# EAGLE schematic LPmini-Prototype_1.1 (EAGLE 6.4)
COMPANY: ADAFRUIT INDUSTRIES; DRAWN: KTOWN; REV: B
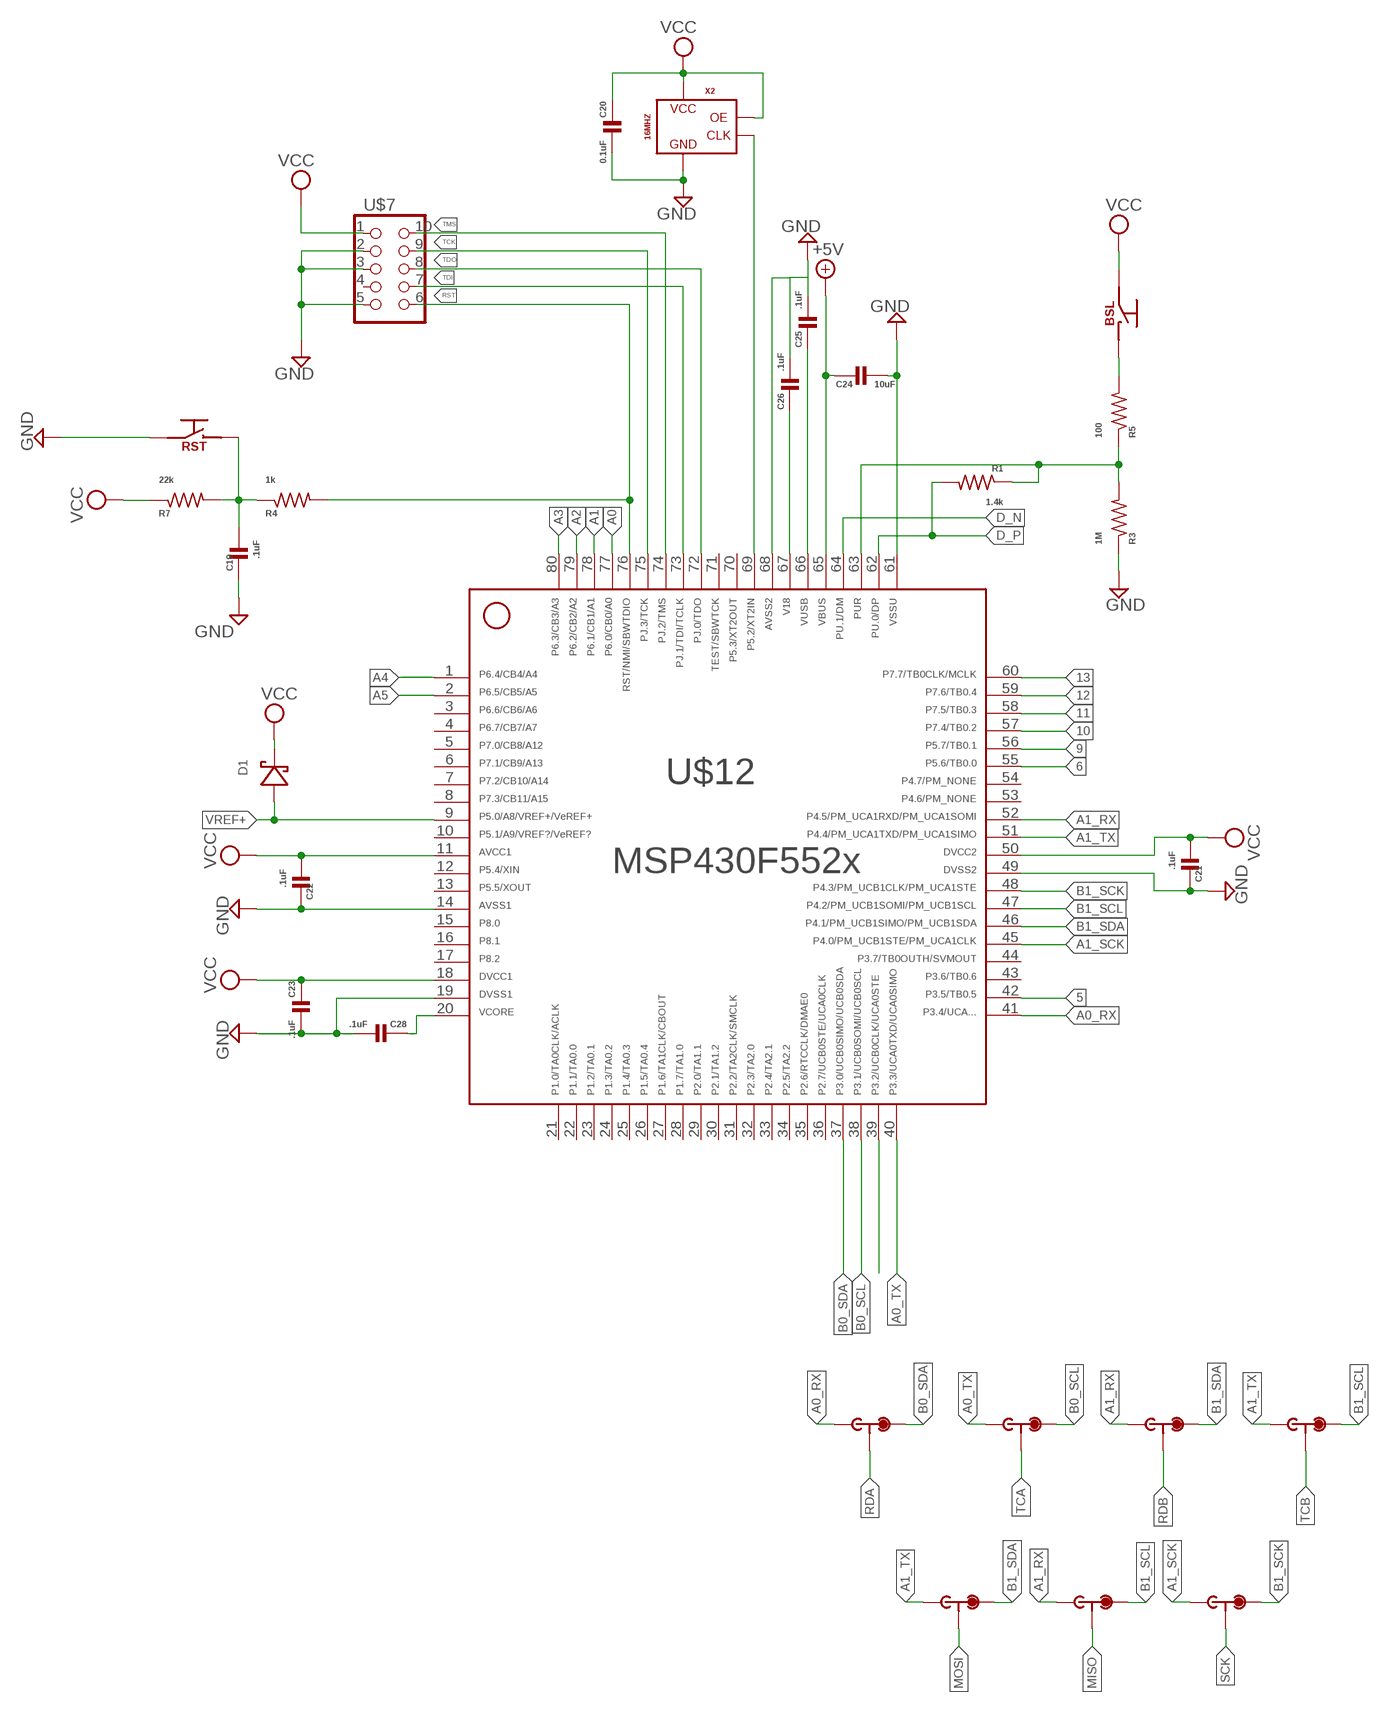
[diagram p0: schematic, sheet 1, part 1 of 2]
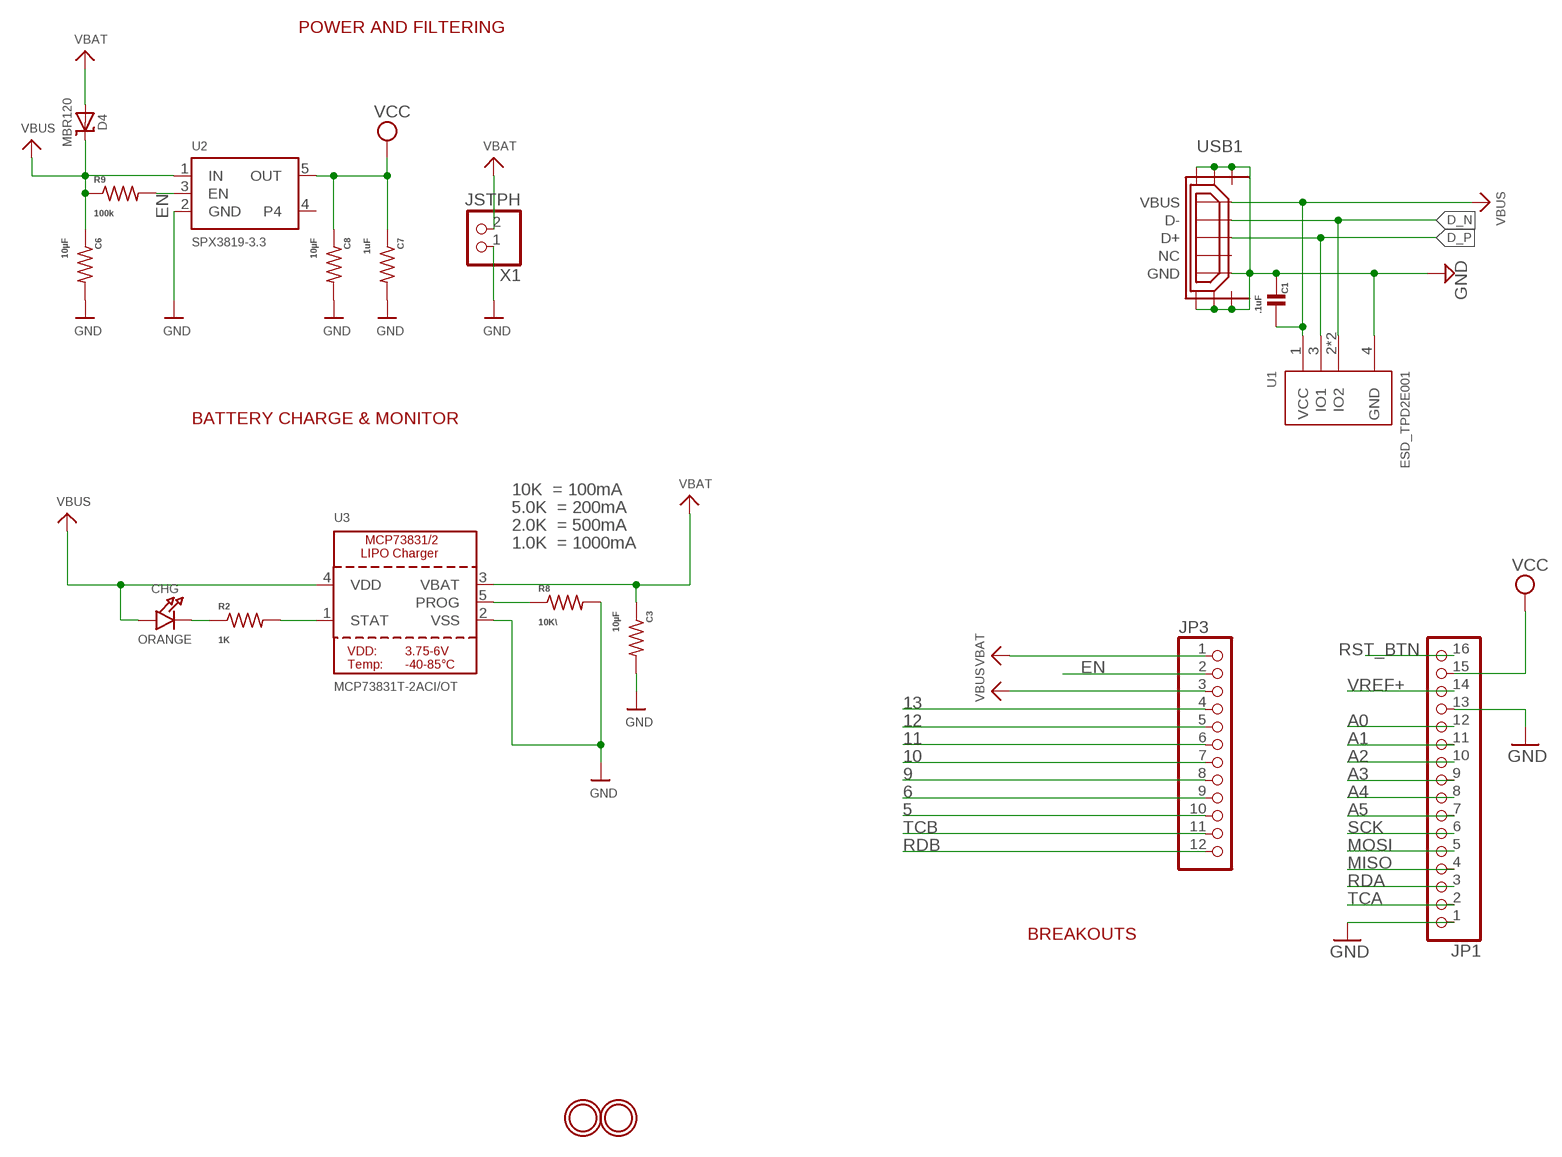
[diagram p1: schematic, sheet 1, part 2 of 2]

## Parts
BSL  PB_SMALL_SMD  [PB_KMR2]
C1  .1uF  C-EUC0402  [C0402]
C3  10µF  R-US_R0603  [R0603]
C6  10µF  R-US_R0603  [R0603]
C7  1uF  R-US_R0402  [R0402]
C8  10µF  R-US_R0603  [R0603]
C19  .1uF  C-EUC0402  [C0402]
C20  0.1uF  C-EUC0402  [C0402]
C21  .1uF  C-EUC0402  [C0402]
C22  .1uF  C-EUC0402  [C0402]
C23  .1uF  C-EUC0402  [C0402]
C24  10uF  C-EUC0603  [C0603]
C25  .1uF  C-EUC0402  [C0402]
C26  .1uF  C-EUC0402  [C0402]
C28  .1uF  C-EUC0402  [C0402]
CHG  ORANGE  LED0805_NOOUTLINE  [CHIPLED_0805_NOOUTLINE]
D1  0_JOSEPH_SDIODE0603  [0_JOSEPH_D0603]
D4  MBR120  DIODE-SCHOTTKYSOD-123  [SOD-123]
JP1  HEADER-1X16ROUND  [1X16_ROUND]
JP3  HEADER-1X12  [1X12_ROUND]
R1  1.4k  R-US_R0402  [R0402]
R2  1K  R-US_R0402  [R0402]
R3  1M  R-US_R0402  [R0402]
R4  1k  R-US_R0402  [R0402]
R5  100  R-US_R0402  [R0402]
R7  22k  R-US_R0402  [R0402]
R8  10K\  R-US_R0402  [R0402]
R9  100k  R-US_R0402  [R0402]
RST  PB_SMALL_SMD  [PB_KMR2]
U1  ESD_TPD2E001  [PROJECT7264_TPD2E001-DRL]
U2  SPX3819-3.3  VREG_SOT23-5  [SOT23-5]
U3  MCP73831T-2ACI/OT  MCP73831/2  [SOT23-5]
U$2  3PT_SOLDER_JUMPER  [SOLDER_JUMPER_3]
U$4  3PT_SOLDER_JUMPER  [SOLDER_JUMPER_3]
U$5  3PT_SOLDER_JUMPER  [SOLDER_JUMPER_3]
U$6  3PT_SOLDER_JUMPER  [SOLDER_JUMPER_3]
U$7  PINHD_2X05SMD  [2X05-SMALL_SMD]
U$8  3PT_SOLDER_JUMPER  [SOLDER_JUMPER_3]
U$9  3PT_SOLDER_JUMPER  [SOLDER_JUMPER_3]
U$10  3PT_SOLDER_JUMPER  [SOLDER_JUMPER_3]
U$12  TI_MSP430_V16_INTERN_F552X---PN80  [TI_MSP430_V16_INTERN_PN80]
U$31  MOUNTINGHOLE2.5  [MOUNTINGHOLE_2.5_PLATED]
U$32  MOUNTINGHOLE2.5  [MOUNTINGHOLE_2.5_PLATED]
USB1  USB_CON-UPDATE_USB_MICRO_FLIPPED  [USB_CON-UPDATE_HIROSE-ZX62R-B-5P]
X1  JSTPH  CON_JST_PH_2PIN  [JSTPH2]
X2  16MHZ  OSCILLATOR_SMD_PERICOM  [SMD_CRYSTAL_3.2X5_PERICOM]

## Nets
5: JP3.10 U$12.42
6: JP3.9 U$12.55
9: JP3.8 U$12.56
10: JP3.7 U$12.57
11: JP3.6 U$12.58
12: JP3.5 U$12.59
13: JP3.4 U$12.60
+5V: C24.1 U$12.65
A0: JP1.12 U$12.77
A0_RX: U$2.2(NO) U$12.41
A0_TX: U$8.2(NO) U$12.40
A1: JP1.11 U$12.78
A1_RX: U$5.2(NO) U$9.2(NO) U$12.52
A1_SCK: U$6.2(NO) U$12.45
A1_TX: U$4.2(NO) U$10.2(NO) U$12.51
A2: JP1.10 U$12.79
A3: JP1.9 U$12.80
A4: JP1.8 U$12.1
A5: JP1.7 U$12.2
B0_SCL: U$8.1(NC) U$12.38
B0_SDA: U$2.1(NC) U$12.37
B1_SCK: U$6.1(NC) U$12.48
B1_SCL: U$5.1(NC) U$10.1(NC) U$12.47
B1_SDA: U$4.1(NC) U$9.1(NC) U$12.46
D_N: U1.2(IO2) U1.5(IO2) U$12.64 USB1.D-
D_P: R1.2 U1.3(IO1) U$12.62 USB1.D+
EN: JP3.2 R9.2 U2.3(EN)
GND: C1.2 C3.2 C6.2 C7.2 C8.2 C19.2 C20.2 C21.2 C22.2 C23.2 C24.2 C25.2 C26.2 C28.2 JP1.1 JP1.13 R3.1 R8.2 RST.1A(A) RST.1B(A) U1.4(GND) U2.2(GND) U3.2(VSS) U$7.2 U$7.3 U$7.5 U$12.14 U$12.19 U$12.49 U$12.61 U$12.68 USB1.GND USB1.SHIELD1 USB1.SHIELD2 USB1.SHIELD3 USB1.SHIELD4 USB1.SHIELD5 USB1.SHIELD6 X1.1 X2.2
MISO: JP1.4 U$5.C(IN)
MOSI: JP1.5 U$4.C(IN)
N$1: CHG.C R2.1
N$3: R2.2 U3.1(STAT)
N$4: R8.1 U3.5(PROG)
N$5: BSL.2A(B) BSL.2B(B) R5.2
N$6: R1.1 R3.2 R5.1 U$12.63
N$14: U$12.39
N$23: C25.1 U$12.66
N$24: C26.1 U$12.67
N$25: C28.1 U$12.20
N$40: U$12.69 X2.3
RDA: JP1.3 U$2.C(IN)
RDB: JP3.12 U$9.C(IN)
RST: R4.2 U$7.6 U$12.76
RST_BTN: C19.1 JP1.16 R4.1 R7.2 RST.2A(B) RST.2B(B)
SCK: JP1.6 U$6.C(IN)
TCA: JP1.2 U$8.C(IN)
TCB: JP3.11 U$10.C(IN)
TCK: U$7.9 U$12.75
TDI: U$7.7 U$12.73
TDO: U$7.8 U$12.72
TMS: U$7.10 U$12.74
VBAT: C3.1 D4.A JP3.1 U3.3(VBAT) X1.2
VBUS: C1.1 C6.1 CHG.A D4.C JP3.3 R9.1 U1.1(VCC) U2.1(IN) U3.4(VDD) USB1.VBUS
VCC: BSL.1A(A) BSL.1B(A) C7.1 C8.1 C20.1 C21.1 C22.1 C23.1 D1.CA JP1.15 R7.1 U2.5(OUT) U$7.1 U$12.11 U$12.18 U$12.50 X2.1 X2.4
VREF+: D1.AN JP1.14 U$12.9
Unconnected: U2.4 U$7.4 U$12.3 U$12.4 U$12.5 U$12.6 U$12.7 U$12.8 U$12.10 U$12.12 U$12.13 U$12.15 U$12.16 U$12.17 U$12.21 U$12.22 U$12.23 U$12.24 U$12.25 U$12.26 U$12.27 U$12.28 U$12.29 U$12.30 U$12.31 U$12.32 U$12.33 U$12.34 U$12.35 U$12.36 U$12.43 U$12.44 U$12.53 U$12.54 U$12.70 U$12.71 USB1.NC

## Notes on the sheet
- POWER AND FILTERING
- BATTERY CHARGE & MONITOR
- 10K  = 100mA
- 5.0K  = 200mA
- 2.0K  = 500mA
- 1.0K  = 1000mA
- BREAKOUTS

## Library data of the parts
BSL RST = 0Joseph:PB_SMALL_SMD
C1 C19-C26 C28 = rcl:C-EU: CAPACITOR, European symbol
C3 C6-C8 R1-R5 R7-R9 = rcl:R-US_: RESISTOR, American symbol
CHG = microbuilder:LED: LED 0603 - 0603 Surface Mount Package 2mA: Green LED - Low Power (3.9mcd, 2ma, 1.7Vf) - Digikey: 475-2709-2-ND Orange LED - Low Power (9.8mcd, 2ma, 1.8Vf) - Digikey: 475-1194-2-ND Red LED - Low Power (5mcd, 2ma, 1.8Vf) - Digikey: 475-1195-2-ND Yellow LED - Low Power (7mcd, 2ma, 1.8Vf) - Digikey: 475-1196-2-ND 5mA: Blue LED - Low Power (17mcd, 5ma, 2.9Vf) - Digikey: LNJ937W8CRACT-ND 0805 - 0805 Surface Mount Package 2mA: Red LED (8.8mcd, 2mA, 1.8Vf, Clear) - Low Power [Digikey: 475-2510-1-ND] Green LED (5mcd, 2mA, 1.8Vf, Clear) - Low Power [Digikey: 475-2730-1-ND] Yellow LED (11.3mcd, 2mA, 1.8Vf, Clear) - Low Power [Digikey: 475-2555-1-ND] 20mA: Red LED (104mcd, 20mA, Diffused) - LS R976 [Digikey: 475-1278-6-ND] Red LED (12mcd, 20mA, 2.0Vf, Clear) - APT2012EC [Digikey: 754-1128-1-ND] Green LED (15mcd, 20mA, 2.2Vf, Clear) - APT2012GC [Digikey: 754-1131-1-ND] Orange LED (160mcd, 20mA, 2.1Vf, Clear) - APT2012SECK [Digikey: 754-1130-1-ND] 1206 - 1206 Surface Mount Package Green LED (26mcd, 20mA, Diffused) - LG N971 [Digikey: 475-1407-6-ND] Red LED (15mcd, 20mA, Diffused) - LH N974 [Digikey: 475-1416-6-ND] Cree - Cree High-Power Surface Mount LEDs XPEBWT-L1-0000-00D50 - White 111lm 350mA 2.9Vf 6200K 110° XTEAWT-00-0000-00000LEE3 - White 114lm 350mA 2.85Vf 5000K 115° Everlight - Everlight 45-21 Series Surface Mount LEDs 45-21/QK2C-B2832AC2CB2/2T - Warm White 2000mcd 20mA 3.25Vf 3050K 120° 45-21/LK2C-B38452C4CB2/2T - Nuetral White 2000mcd 20mA 3.25Vf 4150K 120° 45-21/LK2C-B50634C6CB2/2T - Cold White 2200mcd 20mA 3.25Vf 5650K 120° PLCC2 Reverse Mount LS T77K-J1L2-1-0-2-R18-Z - Red 11.25mcd 2mA 1.8Vf 630nm 120° LO T77K-L1M2-24-Z - Orange 19.6mcd 2mA 1.8Vf 606nm 120° LY T77K-K2M1-26-Z - Yellow 15.7mcd 2mA 1.8Vf 587nm 120°
D1 = 0Joseph:0_JOSEPH_SDIODE
D4 = microbuilder:DIODE-SCHOTTKY
JP1 = microbuilder:HEADER-1X16: PIN HEADER
JP3 = microbuilder:HEADER-1X12
U1 = 0Joseph:ESD_TPD2E001: TPD2E001 ESD-protection diode array
U2 = microbuilder:VREG_SOT23-5: SOT23-5 Fixed Voltage Regulators Part Current Out V Out V In V Dropout θJA (°C/W) TJ (°C) Digikey Part No. ADP121 150mA 3.3V 3.4-5.5V 0.09V @ 150mA -- -- ADP121-AUJZ33R7CT-ND ADP121 150mA 3.0V 3.1-5.5V 0.09V @ 150mA -- -- ADP121-AUJZ30R7CT-ND ADP122 300mA 3.3V 3.4-5.5V 0.085V @ 300mA -- -- ADP122AUJZ-3.3-R7CT-ND ADP1712 300mA 3.3V 3.5-5.5V 0.17V @ 300mA -- -- ADP1712AUJZ-3.3-R7TR-ND AP7311 (Low Cost) 150mA 3.3V 3.5-6V 0.15V @ 150mA -- -- AP7311-33WG-7DICT-ND LD39015M18R 150mA 1.8V 1.9V-5.5V 0.08V @ 100mA -- -- 497-6977-1-ND LP2985A-33DBVR 150mA 3.3V 3.3-16V 0.28V @ 150mA 206 150 296-18479-1-ND MCP1824T-3302E/OT 300mA 3.3V 3.5V-6V 0.2V @ 300mA -- -- MCP1824T-3302E/OTCT-ND MIC5205-2.5YM5 TR 150mA 2.5V 2.7-16V 0.165V @ 150mA -- -- 576-1257-2-ND MIC5205-3.0YM5 TR 150mA 3.0V 3.2V-16V 0.165V @ 150mA -- -- 576-1258-2-ND MIC5205-3.3YM5 TR 150mA 3.3V 3.5V-16V 0.165V @ 150mA -- -- 576-1259-2-ND TPS780330220 150mA 3.3V+2.2V 3.6-5.5V 250mV Max -- -- 296-23332-1-ND TDA3663/N1,135 100mA 3.3V 3.5-45V 0.18V @ 50mA -- -- 568-5343-1-ND Max operating temp can be calculated using θJA, TJ (max junction temperature), and power in watts. Set the "Maximum Ambient Temperature" until it reaches TJ ("Max Junction Temperature"), which is the absolute limit for safe use of the regulator: Heat Sink Temperature Calculator <http://www.daycounter.com/Calculators/Heat-Sink-Temperature-Calculator.phtml> For example, With 12V source into a 3.3V LP2985 and a 30mA load, we are dissipating (12V-3.3V) * 0.03A = 0.261W. With a θJA of 206 °C/W, a TJ of 150°C, and 261mW we can safely use the chip without a heat sink up to 75°C (=147.1°C Junction Temperature).
U3 = microbuilder:MCP73831/2: MCP73831/2 LIPO Charger VDD: 3.75 - 6V Temp -40 - 85°C Programmable Charge Rate: 15-500mA NOTE: STAT is a tri-state logic output on the MCP73831 and an open-drain output on the MCP73832. SOT23-5 with 4.2V output and tri-state logic on STAT = MCP73831T-2ACI/OT
U$2 U$4-U$6 U$8-U$10 = 0Joseph:3PT_SOLDER_JUMPER
U$7 = 0Joseph:PINHD_2X05
U$12 = 0Joseph:TI_MSP430_V16_INTERN_F552X---PN80: ***MSP430F552X***PN80 http://www.ti.com/lit/gpn/msp430f5529 Rev1.0 06/2010 For F552X where X is 1,5,7,9
U$31 U$32 = microbuilder:MOUNTINGHOLE: Mounting Hole For #2 screws (0.086"/2.18mm width, 0.094"/2.4mm hole) use 2.5mm; BOM: EXCLUDE
USB1 = 0Joseph:USB_CON-UPDATE_USB_MICRO_FLIPPED
X1 = microbuilder:CON_JST_PH_2PIN: JST 2-Pin Right-Angle Connector PH-Series - 4UConnector: 17311 SH-Series - 4UConnector: 07278
X2 = 0Joseph:OSCILLATOR_SMD